# Altium schematic sheet ARM_EURO_Platine5.SchDoc
size A4; PageSetup: Record=PageOptions|CenterHorizontal=True|CenterVertical=True|PrintScale=1.00|XCorrection=1.00|YCorrection=1.00|PrintKind=0|BorderSize=5000000|LeftOffset=0|BottomOffset=0|Orientation=2|PaperLength=1000|PaperWidth=1000|Scale=100|PaperSource=7|PrintQuality=-3|MediaType=1|DitherType=10|PrintScaleMode=1|PaperKind=A4|PaperIndex=9
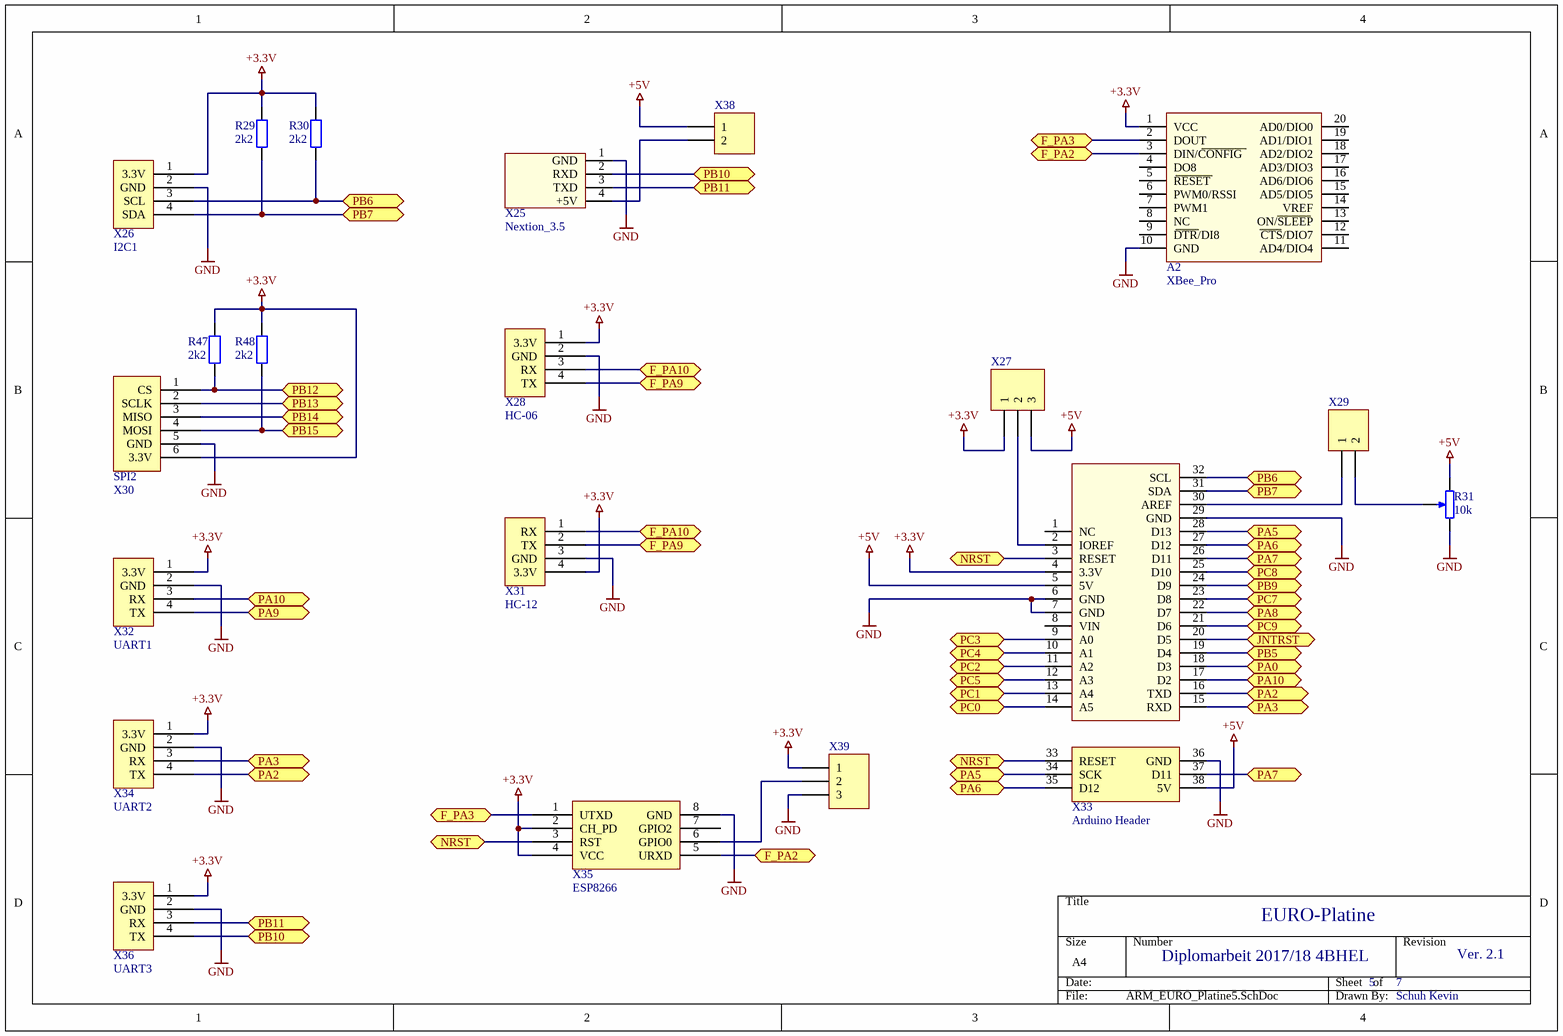
[diagram p0: ARM_EURO_Platine5.SchDoc]

## Parts
A2  XBee_Pro  [XBee_Pro]
R29  value 2k2  [0805_Res]  (hidden comment: Res_SMD)
R30  value 2k2  [0805_Res]  (hidden comment: Res_SMD)
R31  value 10k  [Potentiometer]  (hidden comment: RPot)
R47  value 2k2  [0805_Res]  (hidden comment: Res_SMD)
R48  value 2k2  [0805_Res]  (hidden comment: Res_SMD)
X25  Nextion_3.5  [Nextion_3.5]
X26  I2C1  [I2C_Interface]
X27  Header_3  [HDR1X3]  (value not drawn)
X28  HC-06  [HC_06]
X29  Header  [HDR1X2]  (value not drawn)
X30  SPI2  [SPI_Interface]
X31  HC-12  [HC_12]
X32  UART1  [UART_Interface]
X33  Arduino Header  [Arduino]
X34  UART2  [UART_Interface]
X35  ESP8266  [ESP8266]
X36  UART3  [UART_Interface]
X38  Header  [HDR1X2]  (value not drawn)
X39  Header_3  [HDR1X3]  (value not drawn)

## Ports
F_PA2, F_PA3, F_PA9, F_PA10, JNTRST, NRST, PA0, PA2, PA3, PA5, PA6, PA7, PA8, PA9, PA10, PB5, PB6, PB7, PB9, PB10, PB11, PB12, PB13, PB14, PB15, PC0, PC1, PC2, PC3, PC4, PC5, PC7, PC8, PC9

## Nets
+3.3V: A2.1(VCC) R29.2 R30.2 R47.2 R48.2 X26.1(3.3V) X27.1 X28.1(3.3V) X30.6(3.3V) X31.4(3.3V) X32.1(3.3V) X33.4(3.3V) X34.1(3.3V) X35.2(CH_PD) X35.4(VCC) X36.1(3.3V) X39.1
+5V: R31.1(TOP) X27.3 X33.5(5V) X33.38(5V) X38.1
GND: A2.10(GND) R31.2(BOT) X25.1(GND) X26.2(GND) X28.2(GND) X30.5(GND) X31.3(GND) X32.2(GND) X33.6(GND) X33.7(GND) X33.29(GND) X33.36(GND) X34.2(GND) X35.8(GND) X36.2(GND) X39.3
F_PA2: A2.3(DIN/CONFIG) X35.5(URXD) ; port F_PA2
F_PA3: A2.2(DOUT) X35.1(UTXD) ; port F_PA3
F_PA9: X28.4(TX) X31.2(TX) ; port F_PA9
F_PA10: X28.3(RX) X31.1(RX) ; port F_PA10
JNTRST: X33.20(D5) ; port JNTRST
NRST: X33.3(RESET) X33.33(RESET) X35.3(RST) ; port NRST
PA0: X33.18(D3) ; port PA0
PA2: X33.16(TXD) X34.4(TX) ; port PA2
PA3: X33.15(RXD) X34.3(RX) ; port PA3
PA5: X33.28(D13) X33.34(SCK) ; port PA5
PA6: X33.27(D12) X33.35(D12) ; port PA6
PA7: X33.26(D11) X33.37(D11) ; port PA7
PA8: X33.22(D7) ; port PA8
PA9: X32.4(TX) ; port PA9
PA10: X32.3(RX) X33.17(D2) ; port PA10
PB5: X33.19(D4) ; port PB5
PB6: R30.1 X26.3(SCL) X33.32(SCL) ; port PB6
PB7: R29.1 X26.4(SDA) X33.31(SDA) ; port PB7
PB9: X33.24(D9) ; port PB9
PB10: X25.2(RXD) X36.4(TX) ; port PB10
PB11: X25.3(TXD) X36.3(RX) ; port PB11
PB12: R47.1 X30.1(CS) ; port PB12
PB13: X30.2(SCLK) ; port PB13
PB14: X30.3(MISO) ; port PB14
PB15: R48.1 X30.4(MOSI) ; port PB15
PC0: X33.14(A5) ; port PC0
PC1: X33.13(A4) ; port PC1
PC2: X33.11(A2) ; port PC2
PC3: X33.9(A0) ; port PC3
PC4: X33.10(A1) ; port PC4
PC5: X33.12(A3) ; port PC5
PC7: X33.23(D8) ; port PC7
PC8: X33.25(D10) ; port PC8
PC9: X33.21(D6) ; port PC9
NetR31_3: R31.3(TAP) X29.2
NetX25_4: X25.4(+5V) X38.2
NetX27_2: X27.2 X33.2(IOREF)
NetX29_1: X29.1 X33.30(AREF)
NetX35_6: X35.6(GPIO0) X39.2

Not connected (* = marked no-connect by the designer): A2 4(DO8) 5(RESET) 6(PWM0/RSSI) 7(PWM1) 8(NC) 9(DTR/DI8) 11(AD4/DIO4) 12(CTS/DIO7) 13(ON/SLEEP) 14(VREF) 15(AD5/DIO5) 16(AD6/DIO6) 17(AD3/DIO3) 18(AD2/DIO2) 19(AD1/DIO1) 20(AD0/DIO0); X33 1(NC) 8(VIN); X35 7(GPIO2)

## Notes on the sheet
- EURO-Platine
- Diplomarbeit 2017/18 4BHEL
- 5
- 7
- Ver. 2.1
- Schuh Kevin

## Library data of the parts
A2 = XBee_Pro: Funkmodul
R29 R30 R47 R48 = Res_SMD: Resistor; Published: 8-Jun-2000; LatestRevisionDate: 17-Jul-2002; LatestRevisionNote: Re-released for DXP Platform.; PackageReference: AXIAL-0.4; Publisher: Altium Limited
R31 = RPot: Potentiometer; Sim Note: Enter the Resistance value and the set point into parameter fields.; Set Position: 0.5; Published: 8-Jun-2000; LatestRevisionDate: 17-Jul-2002; LatestRevisionNote: Re-released for DXP Platform.; PackageReference: VR5; Publisher: Altium Limited
X26 = I2C_Interface: Stiftleiste 4Pol
X27 X39 = Header_3: Header, 3-Pin; LatestRevisionDate: 17-Jul-2002; LatestRevisionNote: Re-released for DXP Platform.; Publisher: Altium Limited
X28 = HC_06: Stiftleiste 4Pol
X29 X38 = Header_2: Header, 2-Pin; LatestRevisionDate: 17-Jul-2002; LatestRevisionNote: Re-released for DXP Platform.; Publisher: Altium Limited
X30 = SPI_Interface: Stiftleiste 6Pol
X31 = HC_12
X32 X34 X36 = UART_Interface: Stiftleiste 4Pol
X33 = Arduino
X35 = ESP8266: W-LAN Modul